# EAGLE design schematic_v1 (EAGLE 9.6.2)
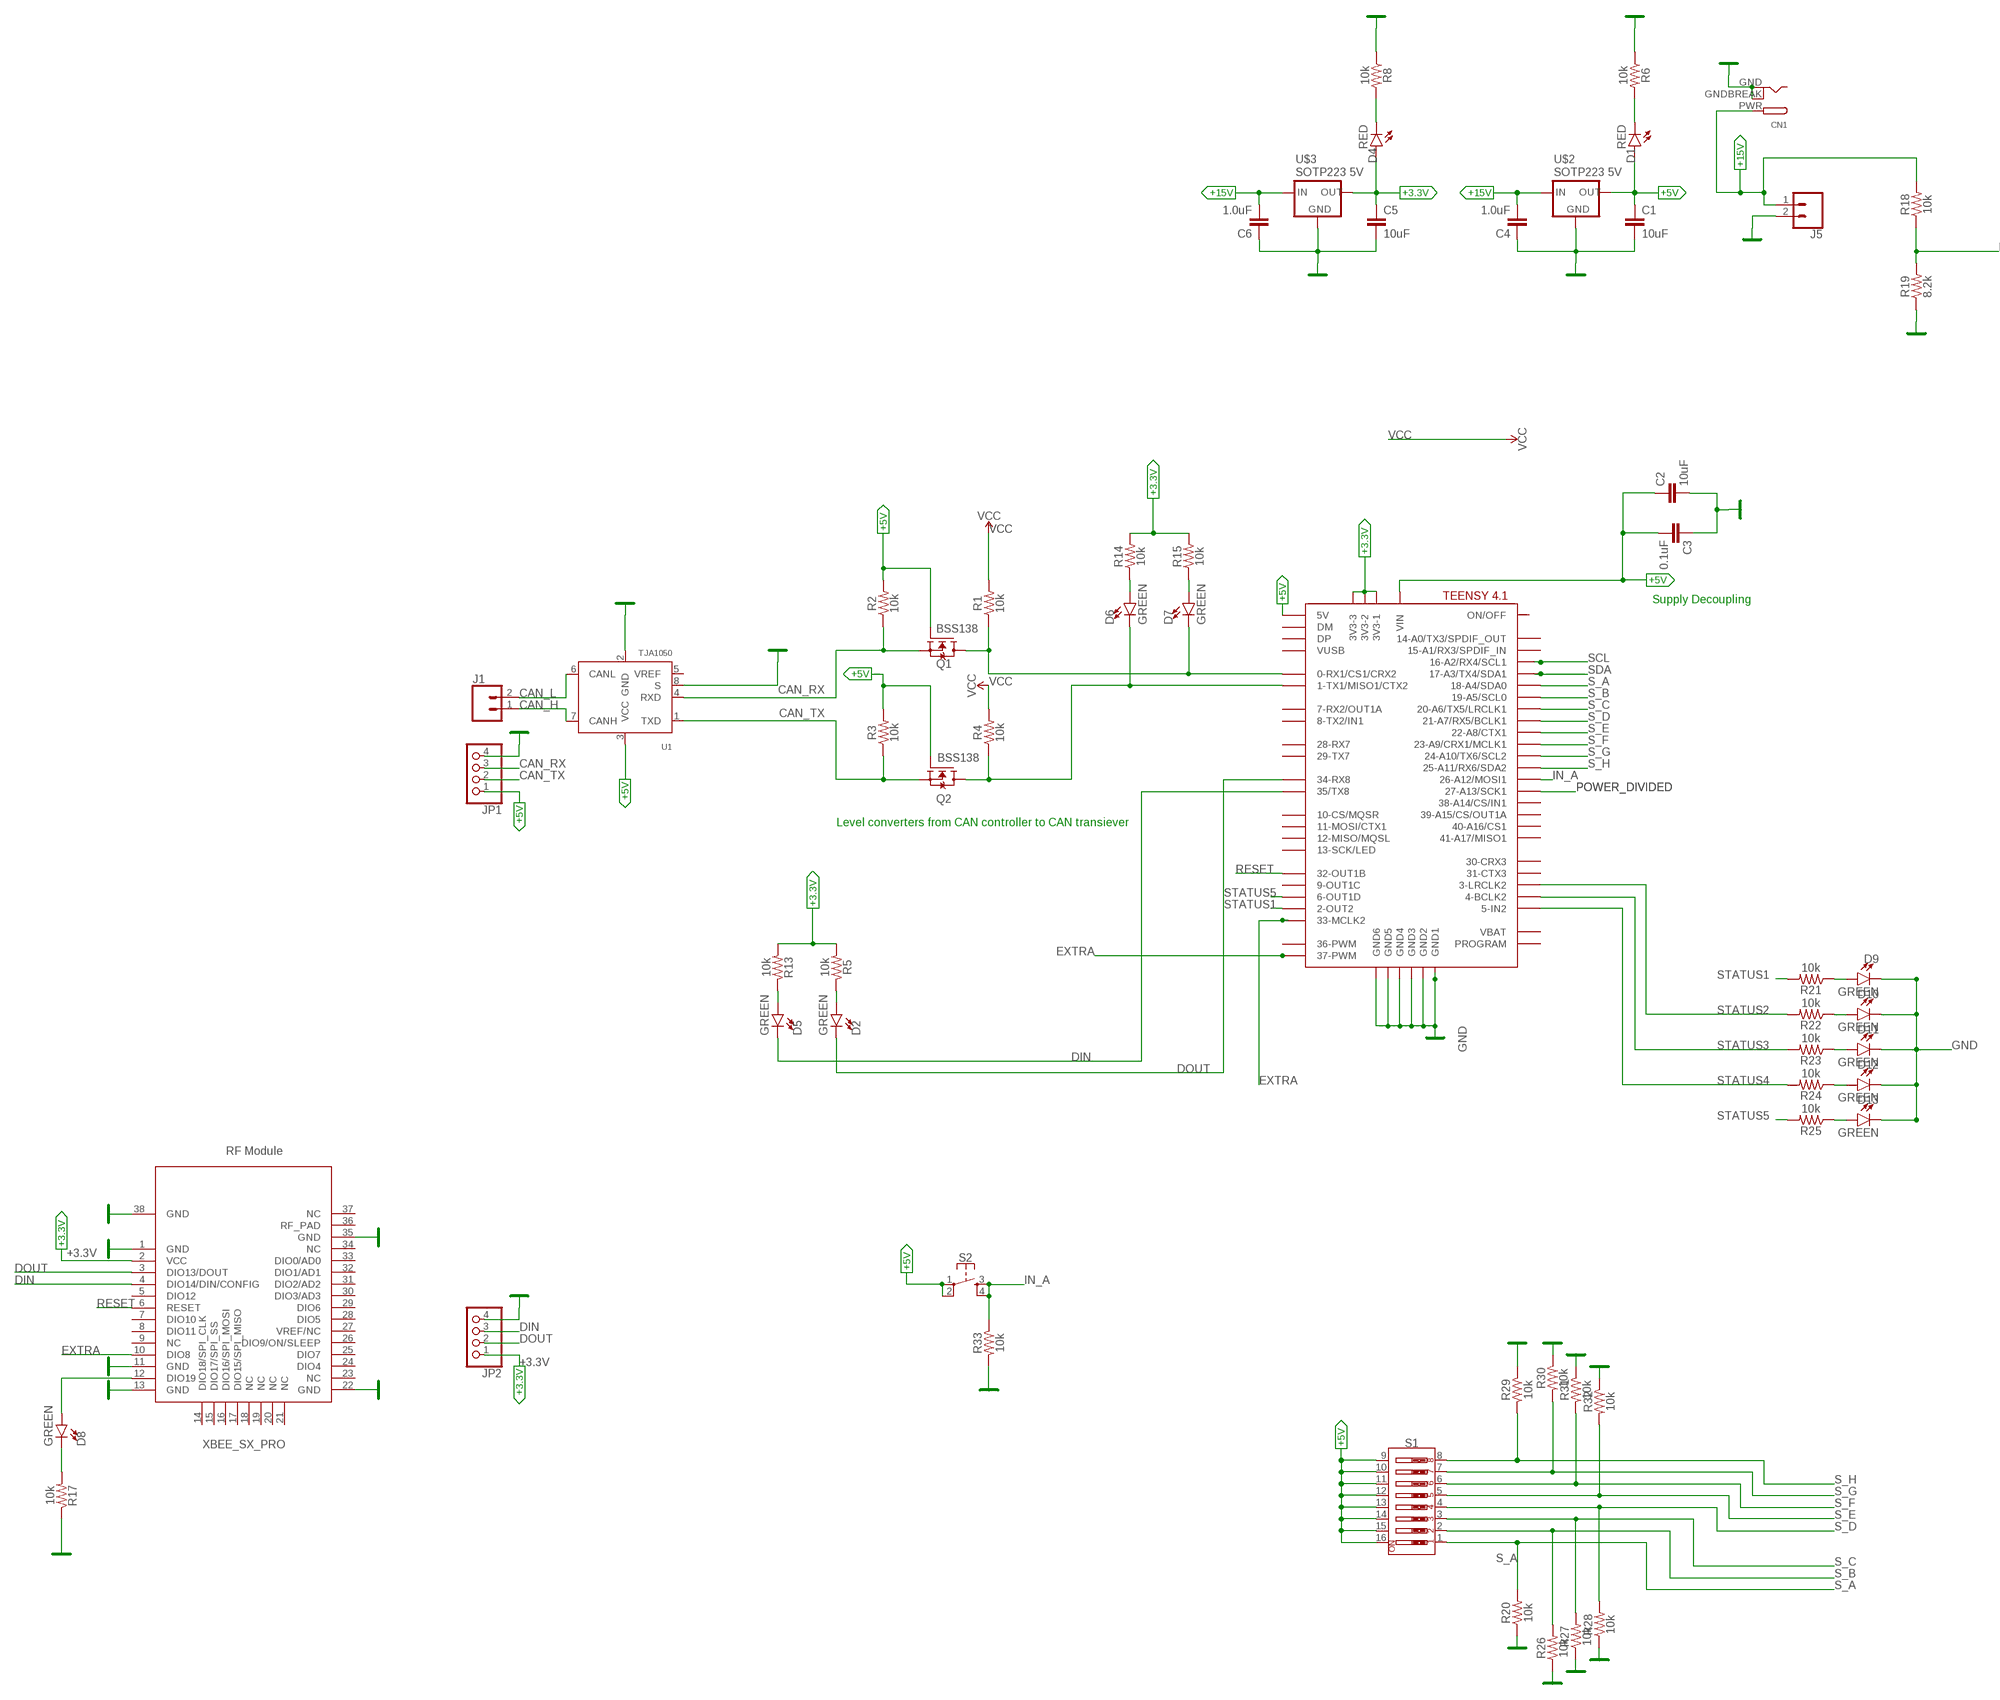
[diagram p0: schematic, sheet 1, part 1 of 2]
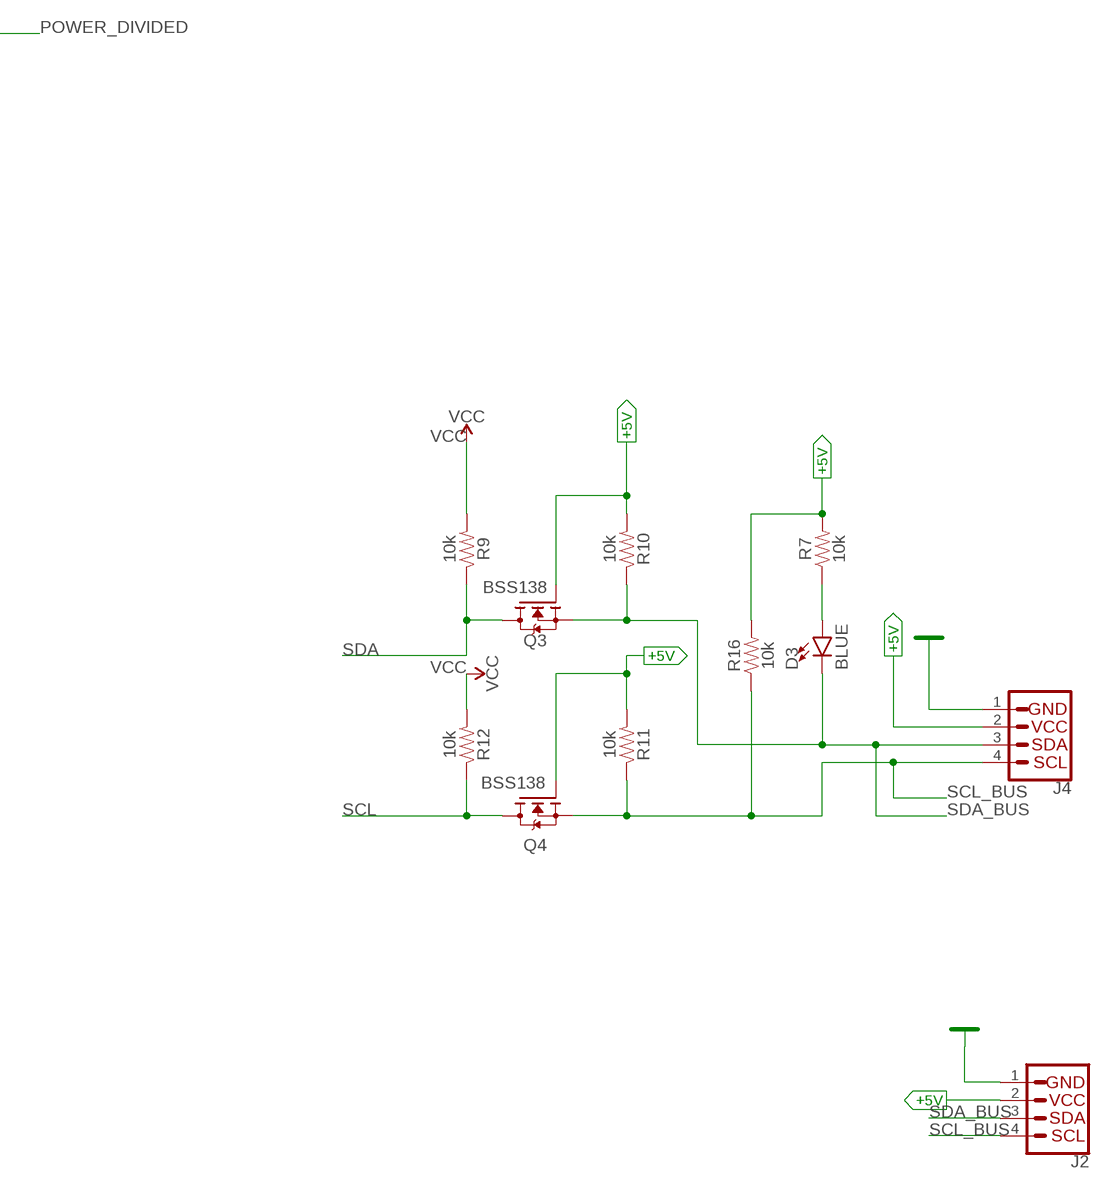
[diagram p1: schematic, sheet 1, part 2 of 2]

## Parts
C1  10uF  10UF-0603-6.3V-20%  [0603]
C2  10uF  10UF-0603-6.3V-20%  [0603]
C3  0.1uF  0.1UF-0603-25V-(+80/-20%)  [0603]
C4  1.0uF  1.0UF-0603-16V-10%  [0603]
C5  10uF  10UF-0603-6.3V-20%  [0603]
C6  1.0uF  1.0UF-0603-16V-10%  [0603]
CN1  DCBARRELPTH  [DCJACK_2MM_PTH]
D1  RED  LED-RED0603  [LED-0603]
D2  GREEN  LED-GREEN0603  [LED-0603]
D3  BLUE  LED-BLUE0603  [LED-0603]
D4  RED  LED-RED0603  [LED-0603]
D5  GREEN  LED-GREEN0603  [LED-0603]
D6  GREEN  LED-GREEN0603  [LED-0603]
D7  GREEN  LED-GREEN0603  [LED-0603]
D8  GREEN  LED-GREEN0603  [LED-0603]
D9  GREEN  LED-GREEN0603  [LED-0603]
D10  GREEN  LED-GREEN0603  [LED-0603]
D11  GREEN  LED-GREEN0603  [LED-0603]
D12  GREEN  LED-GREEN0603  [LED-0603]
D13  GREEN  LED-GREEN0603  [LED-0603]
J1  CONN_02  [1X02]
J2  I2C_STANDARD  [1X04]
J4  I2C_STANDARD  [1X04]
J5  CONN_02LOCK_LONGPADS  [1X02_LOCK_LONGPADS]
JP1  PINHD-1X4  [1X04]
JP2  PINHD-1X4  [1X04]
Q1  BSS138  [SOT95P240X111-3N]
Q2  BSS138  [SOT95P240X111-3N]
Q3  BSS138  [SOT95P240X111-3N]
Q4  BSS138  [SOT95P240X111-3N]
R1  10k  10KOHM-0603-1/10W-1%  [0603]
R2  10k  10KOHM-0603-1/10W-1%  [0603]
R3  10k  10KOHM-0603-1/10W-1%  [0603]
R4  10k  10KOHM-0603-1/10W-1%  [0603]
R5  10k  10KOHM-0603-1/10W-1%  [0603]
R6  10k  10KOHM-0603-1/10W-1%  [0603]
R7  10k  10KOHM-0603-1/10W-1%  [0603]
R8  10k  10KOHM-0603-1/10W-1%  [0603]
R9  10k  10KOHM-0603-1/10W-1%  [0603]
R10  10k  10KOHM-0603-1/10W-1%  [0603]
R11  10k  10KOHM-0603-1/10W-1%  [0603]
R12  10k  10KOHM-0603-1/10W-1%  [0603]
R13  10k  10KOHM-0603-1/10W-1%  [0603]
R14  10k  10KOHM-0603-1/10W-1%  [0603]
R15  10k  10KOHM-0603-1/10W-1%  [0603]
R16  10k  10KOHM-0603-1/10W-1%  [0603]
R17  10k  10KOHM-0603-1/10W-1%  [0603]
R18  10k  10KOHM-0603-1/10W-1%  [0603]
R19  8.2k  8.2KOHM-0603-1/10W-5%  [0603]
R20  10k  10KOHM-0603-1/10W-1%  [0603]
R21  10k  10KOHM-0603-1/10W-1%  [0603]
R22  10k  10KOHM-0603-1/10W-1%  [0603]
R23  10k  10KOHM-0603-1/10W-1%  [0603]
R24  10k  10KOHM-0603-1/10W-1%  [0603]
R25  10k  10KOHM-0603-1/10W-1%  [0603]
R26  10k  10KOHM-0603-1/10W-1%  [0603]
R27  10k  10KOHM-0603-1/10W-1%  [0603]
R28  10k  10KOHM-0603-1/10W-1%  [0603]
R29  10k  10KOHM-0603-1/10W-1%  [0603]
R30  10k  10KOHM-0603-1/10W-1%  [0603]
R31  10k  10KOHM-0603-1/10W-1%  [0603]
R32  10k  10KOHM-0603-1/10W-1%  [0603]
R33  10k  10KOHM-0603-1/10W-1%  [0603]
S1  DIP-08-PTH  [DIPSWITCH-08]
S2  MOMENTARY-SWITCH-SPST-2-SMD-5.2MM  [TACTILE_SWITCH_SMD_5.2MM]
U1  TJA1050  [SOT96-1]
U$1  XBEE_SX_PRO  [XBEE_SX_PRO]
U$2  SOTP223 5V  V_REG_LD1117VXXLD1117-SMD  [SOT223]
U$3  SOTP223 5V  V_REG_LD1117VXXLD1117-SMD  [SOT223]
U$4  TEENSY41-E  [TENNSY41-E]

## Nets
+3.3V: C5.1 D4.A JP2.1 R5.2 R13.2 R14.2 R15.2 U$1.2(VCC) U$3.2(OUT) U$4.3V3-1 U$4.3V3-2 U$4.3V3-3
+5V: C1.1 C2.1 C3.2 D1.A J2.2 J4.2 JP1.1 Q1.1(G) Q2.1(G) Q3.1(G) Q4.1(G) R2.2 R3.2 R7.2 R10.2 R11.2 R16.2 S1.9 S1.10 S1.11 S1.12 S1.13 S1.14 S1.15 S1.16 S2.1 S2.2 U1.3(VCC) U$2.2(OUT) U$4.+5V(5V) U$4.VIN
+15V: C4.2 C6.2 CN1.PWR J5.1 R18.2 U$2.3(IN) U$3.3(IN)
CAN_H: J1.1 U1.7(CANH)
CAN_L: J1.2 U1.6(CANL)
CAN_RX: JP1.3 Q1.2(S) R2.1 U1.4(RXD)
CAN_TX: JP1.2 Q2.2(S) R3.1 U1.1(TXD)
DIN: D5.C JP2.3 U$1.4(DIO14/DIN/CONFIG) U$4.35-TX8(35/TX8)
DOUT: D2.C JP2.2 U$1.3(DIO13/DOUT) U$4.34-RX8
EXTRA: U$1.10(DIO8) U$4.33-MCLK2
GND: C1.2 C2.2 C3.1 C4.1 C5.2 C6.1 CN1.GND CN1.GNDBREAK D9.C D10.C D11.C D12.C D13.C J2.1 J4.1 J5.2 JP1.4 JP2.4 R6.1 R8.1 R17.1 R19.1 R20.1 R26.1 R27.1 R28.1 R29.1 R30.1 R31.1 R32.1 R33.2 U1.2(GND) U1.8(S) U$1.1(GND) U$1.11(GND) U$1.13(GND) U$1.22(GND) U$1.35(GND) U$1.38(GND) U$2.1(GND) U$3.1(GND) U$4.GND1 U$4.GND2 U$4.GND3 U$4.GND4 U$4.GND5 U$4.GND6
IN_A: R33.1 S2.3 S2.4 U$4.26-A12/MOSI1
N$4: D3.A R7.1
N$5: D7.C Q1.3(D) R1.1 U$4.0-RX1/CS1/CRX2
N$6: D5.A R13.1
N$7: D1.C R6.2
N$8: D2.A R5.1
N$10: D4.C R8.2
N$11: D6.C Q2.3(D) R4.1 U$4.1-TX1/MISO1/CTX2
N$12: D8.A U$1.12(DIO19)
N$13: D7.A R15.1
N$14: D6.A R14.1
N$15: U$4.37-PWM
N$16: D9.A R21.1
N$18: D10.A R22.1
N$20: D11.A R23.1
N$22: D12.A R24.1
N$24: D13.A R25.1
N$25: D8.C R17.2
POWER_DIVIDED: R18.1 R19.2 U$4.27-A13/SCK1
RESET: U$1.6(RESET) U$4.32-OUT1B
S_A: R20.2 S1.1 U$4.18-A4/SDA0
S_B: R26.2 S1.2 U$4.19-A5/SCL0
S_C: R27.2 S1.3 U$4.20-A6/TX5/LRCLK1
S_D: R28.2 S1.4 U$4.21-A7/RX5/BCLK1
S_E: R32.2 S1.5 U$4.22-A8/CTX1
S_F: R31.2 S1.6 U$4.23-A9/CRX1/MCLK1
S_G: R30.2 S1.7 U$4.24-A10/TX6/SCL2
S_H: R29.2 S1.8 U$4.25-A11/RX6/SDA2
SCL: Q4.3(D) R12.1 U$4.16-A2/RX4/SCL1
SCL_BUS: J2.4 J4.4 Q4.2(S) R11.1 R16.1
SDA: Q3.3(D) R9.1 U$4.17-A3/TX4/SDA1
SDA_BUS: D3.C J2.3 J4.3 Q3.2(S) R10.1
STATUS1: R21.2 U$4.2-OUT2
STATUS2: R22.2 U$4.3-LRCLK2
STATUS3: R23.2 U$4.4-BCLK2
STATUS4: R24.2 U$4.5-IN2
STATUS5: R25.2 U$4.6-OUT1D
VCC: R1.2 R4.2 R9.2 R12.2
Unconnected: U1.5(VREF) U$1.5(DIO12) U$1.7(DIO10) U$1.8(DIO11) U$1.9(NC) U$1.14(DIO18/SPI_CLK) U$1.15(DIO17/SPI_SS) U$1.16(DIO16/SPI_MOSI) U$1.17(DIO15/SPI_MISO) U$1.18(NC) U$1.19(NC) U$1.20(NC) U$1.21(NC) U$1.23(NC) U$1.24(DIO4) U$1.25(DIO7) U$1.26(DIO9/ON/SLEEP) U$1.27(VREF/NC) U$1.28(DIO5) U$1.29(DIO6) U$1.30(DIO3/AD3) U$1.31(DIO2/AD2) U$1.32(DIO1/AD1) U$1.33(DIO0/AD0) U$1.34(NC) U$1.36(RF_PAD) U$1.37(NC) U$4.7-RX2/OUT1A U$4.8-TX2/IN1 U$4.9-OUT1C U$4.10-CS\MQSR(10-CS/MQSR) U$4.11-MOSI/CTX1 U$4.12-MISO/MQSL U$4.13-SCK/LED U$4.14-A0/TX3/SPDIF_OUT U$4.15-A1/RX3/SPDIF_IN U$4.28-RX7 U$4.29-TX7 U$4.30-CRX3 U$4.31-CTX3 U$4.36-PWM U$4.38-A14/CS/IN1 U$4.39-A15/CS/OUT1A U$4.40-A16/CS1 U$4.41-A17/MISO1 U$4.DM U$4.DP U$4.ON/OFF U$4.PROGRAM U$4.VBAT U$4.VUSB

## Notes on the sheet
- Supply Decoupling
- Level converters from CAN controller to CAN transiever

## Library data of the parts
C1 C2 C5 = SparkFun-Capacitors:10UF: 10.0µF ceramic capacitors A capacitor is a passive two-terminal electrical component used to store electrical energy temporarily in an electric field.; PROD_ID: CAP-11015
C3 = SparkFun-Capacitors:0.1UF: 0.1µF ceramic capacitors A capacitor is a passive two-terminal electrical component used to store electrical energy temporarily in an electric field.; PROD_ID: CAP-00810
C4 C6 = SparkFun-Capacitors:1.0UF: 1µF ceramic capacitors A capacitor is a passive two-terminal electrical component used to store electrical energy temporarily in an electric field.; PROD_ID: CAP-00868
CN1 = adafruit:DCBARREL: 2.0mm DC Barrel Jack DCJACK_2MM_PTH - Through Hole Jack (4UConnector: 05537)
D1 D4 = SparkFun-LED:LED-RED: Red SMD LED Used in manufacturing of most products at SparkFun Packages: 0603 - SMD 0603 package [Product Link] <http://docs.avagotech.com/docs/AV02-0551EN> 0603 SMART - SMD 0603 SMART package ( more efficient and expensive)[Product Link] <http://www.osram-os.com/Graphics/XPic2/00077099_0.pdf> 1206 - SMD1206 package [Product Link] <https://www.sparkfun.com/datasheets/DevTools/LilyPad/Q150OVS4.pdff> SparkFun Products: Pro Mini 328 -5V <https://www.sparkfun.com/products/821> RedBoard <https://www.sparkfun.com/products/12757> IOIO-OTG <https://www.sparkfun.com/products/13613>; PROD_ID: DIO-00819
D2 D5-D13 = SparkFun-LED:LED-GREEN: Green SMD LED Used in manufacturing of various products at SparkFun Packages: 0603 - SMD 0603 package [Product Link] <http://www.futureelectronics.com/en/technologies/semiconductors/optoelectronics/leds/Pages/9894312-LTST-C190GKT.aspx?CrossPart=HSMG-C190&IM=0> LilyPad 1206 - SMD1206 LilyPad package [Product Link] <http://www.futureelectronics.com/en/Technologies/Product.aspx?ProductID=IN150NGHARVATEKCORPORATION2049943&IM=0> 1206 - SMD1206 package [Product Link] <http://www.futureelectronics.com/en/technologies/semiconductors/optoelectronics/leds/Pages/8315665-LTST-C150KGKT.aspx?IM=0> 1206 Bottom Mount -SMD 1206 Bottom Mount [Product Link] <http://www.digikey.com/product-detail/en/lite-on-inc/LTST-C230KGKT/160-1456-1-ND/386854> SparkFun Products: Pro Mini 328 -5V <https://www.sparkfun.com/products/821> RedBoard <https://www.sparkfun.com/products/12757> MP3 Trigger <https://www.sparkfun.com/products/13720> Makey Makey <https://www.sparkfun.com/products/11076>; PROD_ID: DIO-00821
D3 = SparkFun-LED:LED-BLUE: Blue SMD LED Used in manufacturing of various products at SparkFun Packages: 0603 - SMD 0603 package [Product Link] <http://www.digikey.com/product-detail/en/SMLE12BC7TT86/511-1589-2-ND/1641808> 1206 - SMD1206 package [Product Link] <http://www.digikey.com/product-detail/en/lite-on-inc/LTST-C150TBKT/160-1643-1-ND/573584> SparkFun Products: ESP8266 Thing-Dev Board <https://www.sparkfun.com/products/13711> RedBoard <https://www.sparkfun.com/products/12757>; PROD_ID: DIO-08575
J1 J5 = SparkFun-Connectors:CONN_02: Multi connection point. Often used as Generic Header-pin footprint for 0.1 inch spaced/style header connections On any of the 0.1 inch spaced packages, you can populate with these: Break Away Headers - Straight <https://www.sparkfun.com/products/116> (PRT-00116) Break Away Male Headers - Right Angle <https://www.sparkfun.com/products/553> (PRT-00553) Female Headers <https://www.sparkfun.com/products/115> (PRT-00115) Break Away Headers - Machine Pin <https://www.sparkfun.com/products/117> (PRT-00117) Break Away Female Headers - Swiss Machine Pin <https://www.sparkfun.com/products/743> (PRT-00743) For SCREWTERMINALS and SPRING TERMINALS visit here: Screw Terimnals on SparkFun.com <https://www.sparkfun.com/search/results?term=Screw+Terminals> (5mm/3.5mm/2.54mm spacing) This device is also useful as a general connection point to wire up your design to another part of your project. Our various solder wires solder well into these plated through hole pads. Hook-Up Wire - Assortment (Stranded, 22 AWG) <https://www.sparkfun.com/products/11375> (PRT-11375) Hook-Up Wire - Assortment (Solid Core, 22 AWG) <https://www.sparkfun.com/products/11367> (PRT-11367) View the entire wire category on our website here <https://www.sparkfun.com/categories/141> Special notes: Molex polarized connector foot print use with: PRT-08233 with associated crimp pins and housings. 2.54_SCREWTERM for use with PRT-10571. 3.5mm Screw Terminal footprints for PRT-08084 5mm Screw Terminal footprints for use with PRT-08432
J2 J4 = SparkFun-Connectors:I2C_STANDARD: SparkFun I2C Standard Pinout Header SparkFun has standardized on a pinout for all I2C based sensor breakouts. This pinout allows I2C boards to be plugged directly into the headers on Arduino Uno compatible boards, and to be daisy chained easily. Example SparkFun Products: SparkFun Atmospheric Sensor Breakout - BME280 <https://www.sparkfun.com/products/13676> SparkFun Altitude/Pressure Sensor Breakout - MPL3115A2 <https://www.sparkfun.com/products/11084> SparkFun TOF Range Finder Sensor - VL6180 <https://www.sparkfun.com/products/12785>
JP1 JP2 = pinhead:PINHD-1X4: PIN HEADER
Q1 Q2 = BSS138:BSS138: N-Channel 50V 220mA (Ta) 360mW (Ta) Surface Mount SOT-23-3 Check prices <https://pricing.snapeda.com/search/part/BSS138/?ref=eda>; AVAILABILITY: Good; DESCRIPTION: N-Channel 50V 220mA (Ta) 360mW (Ta) Surface Mount SOT-23-3; MF: ON Semiconductor; MP: BSS138; PACKAGE: SOT-23 ON Semiconductor; PRICE: None; PURCHASE-URL: https://pricing.snapeda.com/search/part/BSS138/?ref=eda
Q3 Q4 = BSS138:BSS138: N-Channel 50V 220mA (Ta) 360mW (Ta) Surface Mount SOT-23-3 Check prices <https://pricing.snapeda.com/search/part/BSS138/?ref=eda>; AVAILABILITY: Good; DESCRIPTION: N-Channel 50V 220mA (Ta) 360mW (Ta) Surface Mount SOT-23-3; MF: ON Semiconductor; MP: BSS138; PACKAGE: SOT-23 ON Semiconductor; PRICE: None; PURCHASE-URL: https://pricing.snapeda.com/search/part/BSS138/?ref=eda; SPICEPREFIX: Q
R1-R8 R13-R18 R20-R33 = SparkFun-Resistors:10KOHM: 10kΩ resistor A resistor is a passive two-terminal electrical component that implements electrical resistance as a circuit element. Resistors act to reduce current flow, and, at the same time, act to lower voltage levels within circuits. - Wikipedia; PROD_ID: RES-00824
R9-R12 = SparkFun-Resistors:10KOHM: 10kΩ resistor A resistor is a passive two-terminal electrical component that implements electrical resistance as a circuit element. Resistors act to reduce current flow, and, at the same time, act to lower voltage levels within circuits. - Wikipedia; PROD_ID: RES-00824; SPICEPREFIX: R
R19 = SparkFun-Resistors:8.2KOHM: 8.2kΩ resistor A resistor is a passive two-terminal electrical component that implements electrical resistance as a circuit element. Resistors act to reduce current flow, and, at the same time, act to lower voltage levels within circuits. - Wikipedia; PROD_ID: RES-10646
S1 = SparkFun-Switches:DIP-08: 8-Position DIP Switch 8-circuit DIP (dual inline package) switch. Commonly used to physcially set a circuit's behavior. SparkFun Products DIP Switch - 8 Position <https://www.sparkfun.com/products/8034> (COM-08034); PROD_ID: SWCH-12197; SF_SKU: COM-08034
S2 = SparkFun-Switches:MOMENTARY-SWITCH-SPST-2: Momentary Switch (Pushbutton) - SPST - Two Circuits Normally-open (NO) SPST momentary switches (buttons, pushbuttons). Schematic symbol includes two switch circuits. Variants SMD-4.6MMX2.8MM - 4.60mm x 2.80mm Tactile Momentary Button Switch - Used on SparkFun SAMD21 Mini Breakout <https://www.sparkfun.com/products/13664> SMD-5.2MM - Mini Pushbutton Switch - SMD <https://www.sparkfun.com/products/8720> - Used on Arduino Pro Mini <https://www.sparkfun.com/products/11114>; PROD_ID: SWCH-08247; SF_SKU: COM-08720
U1 = TJA1050:TJA1050: High speed CAN transceiver The TJA1050 is the interface between the Controller Area Network (CAN) protocol controller and the physical bus. The device provides differential transmit capability to the bus and differential receive capability to the CAN controller. The TJA1050 is the third Philips high-speed CAN transceiver after the PCA82C250 and the PCA82C251. The most important differences are: Much lower electromagnetic emission due to optimal matching of the output signals CANH and CANL Improved behaviour in case of an unpowered node No standby mode. This makes the TJA1050 eminently suitable for use in nodes that are in a power-down situation in partially powered networks. AAL Eindhoven MK; AVAILABILITY: Unavailable; DESCRIPTION: 1/1 Transceiver Half CANbus 8-SO; MF: NXP USA; MP: TJA1050; PACKAGE: SOIC-8 NXP Semiconductors; PRICE: None
U$1 = xbee_sx_pro:XBEE_SX_PRO
U$2 U$3 = SparkFun-IC-Power:V_REG_LD1117VXX: LD1117VXX voltage regulator. We carry the 3.3V version (COM-00526) in TO-220 package.; PROD_ID: VREG-13917
U$4 = teensy:TEENSY41-E

## Board
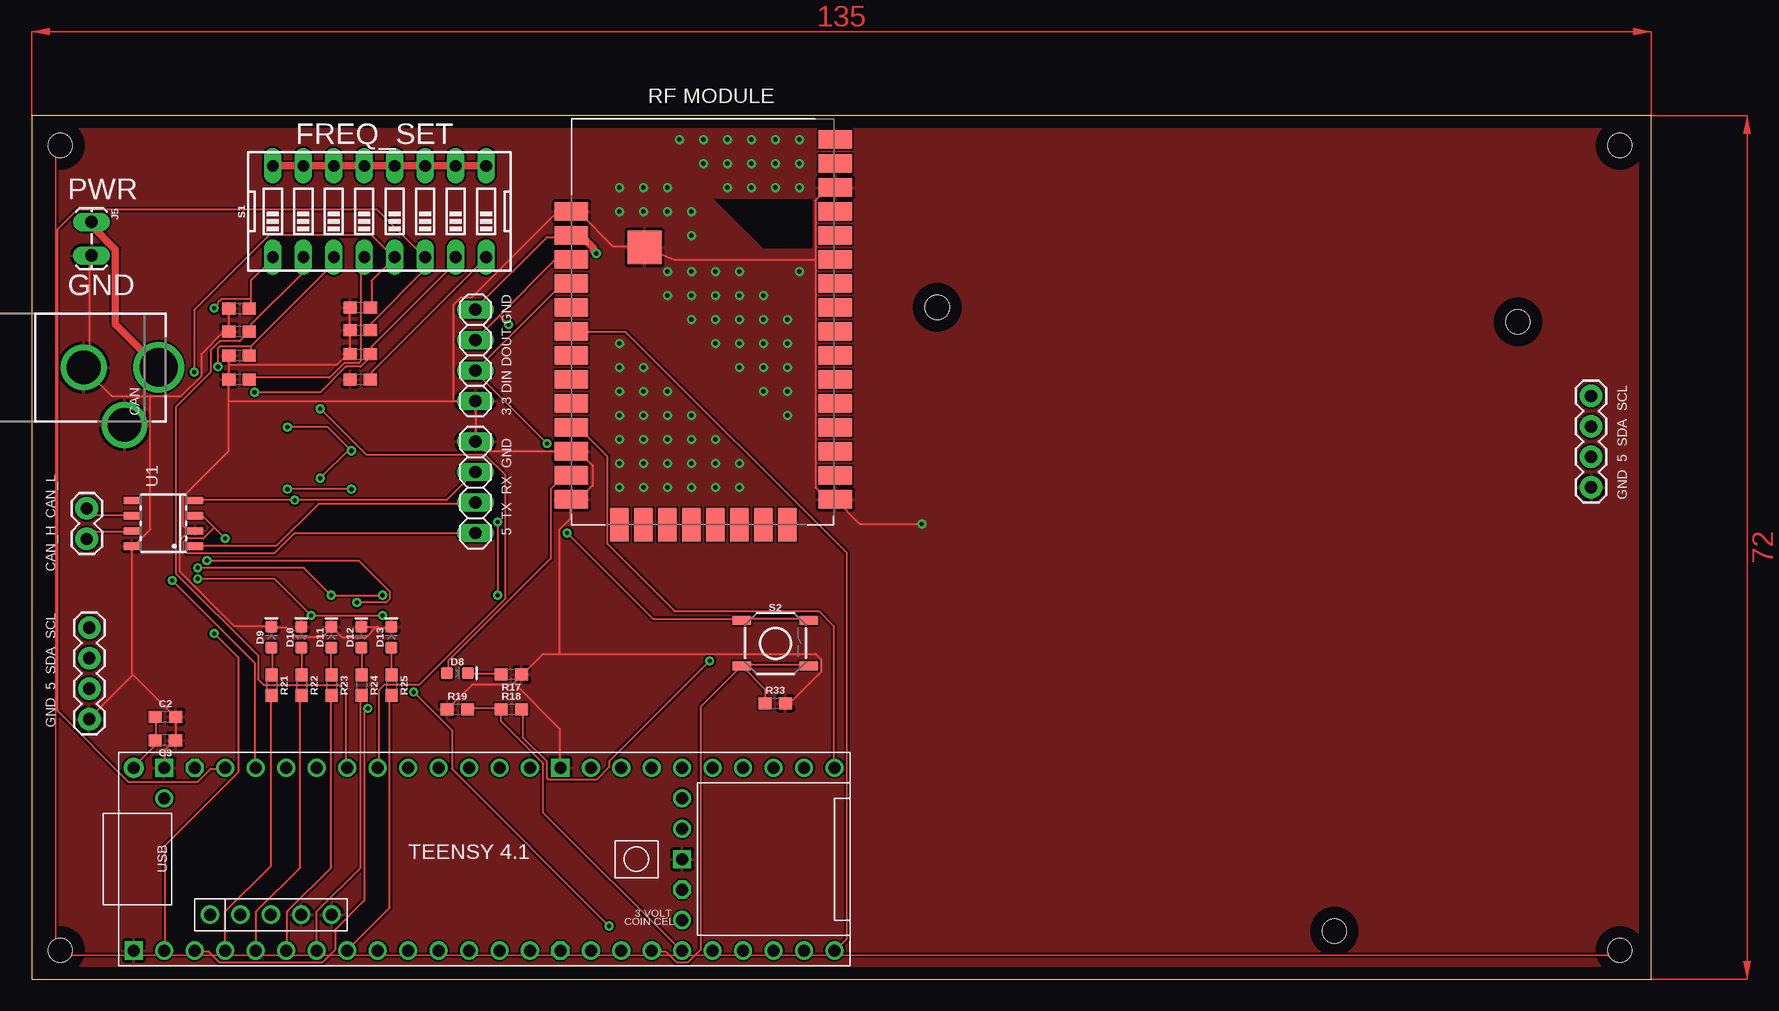
[diagram p2: board, top side]
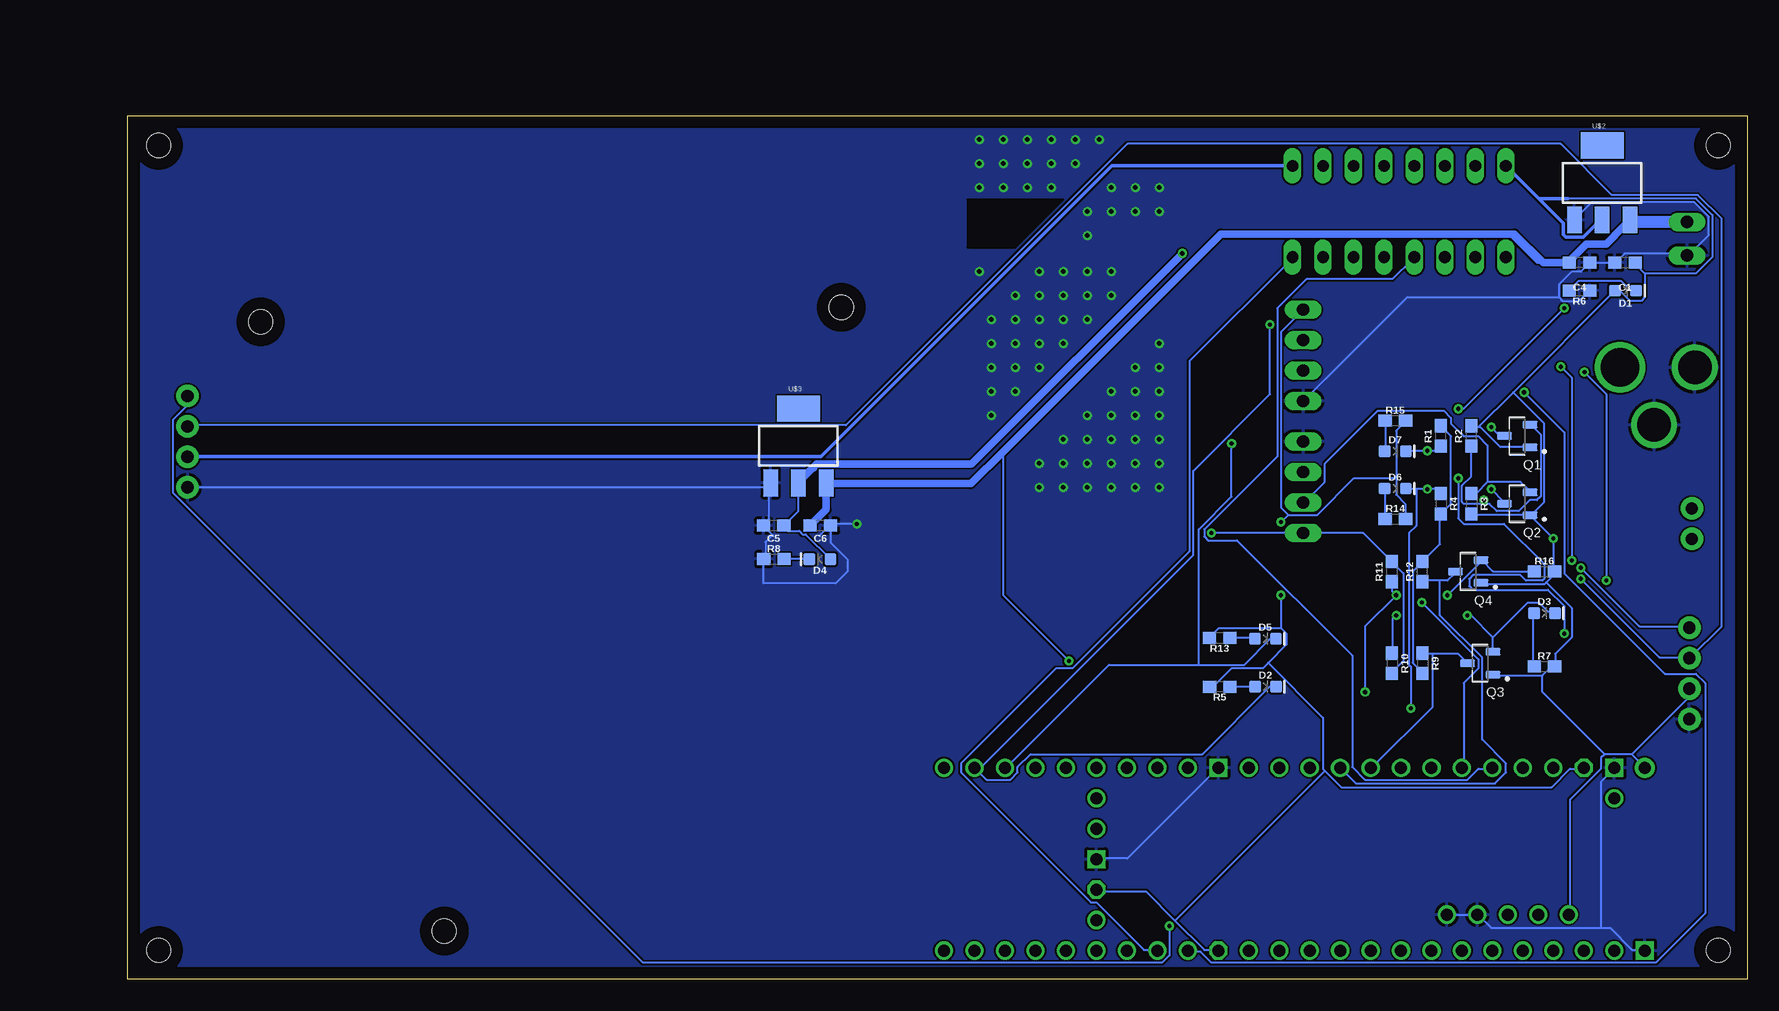
[diagram p3: board, bottom side, seen from below]

Size 135 x 72 mm. Coordinates in mm from the lower left corner, seen from the top.
Outline: 0,0 135,0 135,72 0,72 0,0
Copper layers (1*16): Top 0.035mm / dielectric 1.5mm / Bottom 0.035mm
Design rules "default": minimum track width 6mil, minimum drill 0.35mm, track to track 6mil, track to pad 6mil, pad to pad 6mil, via to via 6mil, smd to smd 6mil, copper to edge 40mil, drill to drill 6mil, minimum pad ring 10mil, minimum via ring 8mil, stop-mask expansion 4mil, vias tented up to drill 0mil, thermal gap 10mil
Holes 2 mm at 132.4,69.5 2.4,2.4 132.4,2.4 2.4,69.5 123.9,54.8 108.6,4 75.5,56
tRestrict: area 57,61 to 65,65
bRestrict: area 57,61 to 65,65

### Footprints (pad centres in the part's own frame; a part is rotated, then mirrored left to right if it is on the bottom)
0603 = smd 1.1 x 1: 1 -0.85,0; 2 0.85,0
DCJACK_2MM_PTH = drill 2.8: GND 0,7.35; GNDBREAK 4.8,10.75 | drill 3.2: PWR 0,13.6
LED-0603 = smd 1 x 1: A -0.877,0; C 0.877,0
1X02 = drill 1.016 pad 1.88: 1 0,0; 2 2.54,0
1X04 = drill 1.016 pad 1.88: 1 0,0; 2 2.54,0; 3 5.08,0; 4 7.62,0
1X02_LOCK_LONGPADS = drill 1.016 long: 1 -0.127,0; 2 2.667,0
1X04' = drill 1.016 long: 1 -3.81,0; 2 -1.27,0; 3 1.27,0; 4 3.81,0
SOT95P240X111-3N = smd 1.23 x 0.6: 1 -1.06,0.95; 2 -1.06,-0.95; 3 1.06,0
DIPSWITCH-08 = drill 0.97 long: 1 -8.89,-3.81; 2 -6.35,-3.81; 3 -3.81,-3.81; 4 -1.27,-3.81; 5 1.27,-3.81; 6 3.81,-3.81; 7 6.35,-3.81; 8 8.89,-3.81; 9 8.89,3.81; 10 6.35,3.81; 11 3.81,3.81; 12 1.27,3.81; 13 -1.27,3.81; 14 -3.81,3.81; 15 -6.35,3.81; 16 -8.89,3.81
TACTILE_SWITCH_SMD_5.2MM = smd 1.524 x 0.762: 1 -2.794,1.905; 2 2.794,1.905; 3 -2.794,-1.905; 4 2.794,-1.905
SOT96-1 = smd 0.6 x 1.3: 1 -1.905,-2.65; 2 -0.635,-2.65; 3 0.635,-2.65; 4 1.905,-2.65; 5 1.905,2.65; 6 0.635,2.65; 7 -0.635,2.65; 8 -1.905,2.65
XBEE_SX_PRO = smd 2.8 x 1.52: 1 0,24; 2 0,22; 3 0,20; 4 0,18; 5 0,16; 6 0,14; 7 0,12; 8 0,10; 9 0,8; 10 0,6; 11 0,4; 12 0,2; 13 0,0; 22 22,0; 23 22,2; 24 22,4; 25 22,6; 26 22,8; 27 22,10; 28 22,12; 29 22,14; 30 22,16; 31 22,18; 32 22,20; 33 22,22; 34 22,24; 35 22,26; 36 22,28; 37 22,30 | smd 1.52 x 2.8: 14 4,-2.127; 15 6,-2.127; 16 8,-2.127; 17 10,-2.127; 18 12,-2.127; 19 14,-2.127; 20 16,-2.127; 21 18,-2.127 | smd 2.8 x 2.8: 38 6.1,21
SOT223 = smd 1.219 x 2.235: 1 -2.311,-3.099; 2 0,-3.099; 3 2.311,-3.099 | smd 3.6 x 2.2: 4 0,3.099
TENNSY41-E = drill 1: 0-RX1/CS1/CRX2 -27.94,-7.62; 1-TX1/MISO1/CTX2 -25.4,-7.62; 2-OUT2 -22.86,-7.62; 3-LRCLK2 -20.32,-7.62; 4-BCLK2 -17.78,-7.62; 5-IN2 -15.24,-7.62; 6-OUT1D -12.7,-7.62; 7-RX2/OUT1A -10.16,-7.62; 8-TX2/IN1 -7.62,-7.62; 9-OUT1C -5.08,-7.62; 10-CS\MQSR -2.54,-7.62; 11-MOSI/CTX1 0,-7.62; 12-MISO/MQSL 2.54,-7.62; 13-SCK/LED 2.54,7.62; 14-A0/TX3/SPDIF_OUT 0,7.62; 15-A1/RX3/SPDIF_IN -2.54,7.62; 16-A2/RX4/SCL1 -5.08,7.62; 17-A3/TX4/SDA1 -7.62,7.62; 18-A4/SDA0 -10.16,7.62; 19-A5/SCL0 -12.7,7.62; 20-A6/TX5/LRCLK1 -15.24,7.62; 21-A7/RX5/BCLK1 -17.78,7.62; 22-A8/CTX1 -20.32,7.62; 23-A9/CRX1/MCLK1 -22.86,7.62; 24-A10/TX6/SCL2 7.62,-7.62; 25-A11/RX6/SDA2 10.16,-7.62; 26-A12/MOSI1 12.7,-7.62; 27-A13/SCK1 15.24,-7.62; 28-RX7 17.78,-7.62; 29-TX7 20.32,-7.62; 30-CRX3 22.86,-7.62; 31-CTX3 25.4,-7.62; 32-OUT1B 27.94,-7.62; 33-MCLK2 27.94,7.62; 34-RX8 25.4,7.62; 35-TX8 22.86,7.62; 36-PWM 20.32,7.62; 37-PWM 17.78,7.62; 38-A14/CS/IN1 15.24,7.62; 39-A15/CS/OUT1A 12.7,7.62; 40-A16/CS1 10.16,7.62; 41-A17/MISO1 7.62,7.62; +5V -24.13,-4.62; DM -21.59,-4.62; DP -19.05,-4.62; GND4 -16.51,-4.62; GND5 -13.97,-4.62; ON/OFF 15.24,5.08; PROGRAM 15.24,2.54; VBAT 15.24,-5.08; VUSB -27.94,5.08 | drill 1 octagon: 3V3-1 5.08,-7.62; 3V3-2 15.24,-2.54; 3V3-3 -25.4,7.62 | drill 1 square: GND1 -30.48,-7.62; GND2 15.24,0; GND3 5.08,7.62; GND6 -27.94,7.62 | drill 1 pad 1.676: VIN -30.48,7.62

### Placement (x,y rotation side)
C1  10.17,59.72 180 bottom
C2  11.16,21.88 0 top
C3  11.15,19.92 180 top
C4  13.97,59.74 180 bottom
C5  81.14,37.8 180 bottom
C6  77.25,37.8 180 bottom
CN1  -3,51 270 top
D1  10.13,57.4 0 bottom
D2  40.14,24.39 0 bottom
D3  16.89,30.52 0 bottom
D4  77.28,35.01 180 bottom
D5  40.15,28.39 0 bottom
D6  29.32,40.9 0 bottom
D7  29.32,44.01 0 bottom
D8  35.5,25.5 0 top
D9  20,28.5 90 top
D10  22.5,28.5 90 top
D11  25,28.5 90 top
D12  27.5,28.5 90 top
D13  30,28.5 90 top
J1  4.6,36.7 90 top
J2  130,41 90 top
J4  4.81,21.67 90 top
J5  5,63 270 top
JP1  [1X04']  37,41 90 top
JP2  [1X04']  37,52 270 top
Q1  19.16,45.28 180 bottom
Q2  19.16,39.63 180 bottom
Q3  22.24,26.33 180 bottom
Q4  23.24,33.98 180 bottom
R1  25.51,45.28 90 bottom
R2  22.97,45.28 90 bottom
R3  22.97,39.63 270 bottom
R4  25.51,39.63 270 bottom
R5  43.95,24.37 180 bottom
R6  13.97,57.38 180 bottom
R7  16.89,26.06 0 bottom
R8  81.12,35.01 0 bottom
R9  27.05,26.33 270 bottom
R10  29.59,26.33 270 bottom
R11  29.59,33.98 90 bottom
R12  27.05,33.98 90 bottom
R13  43.97,28.43 180 bottom
R14  29.32,38.36 0 bottom
R15  29.32,46.55 0 bottom
R16  16.89,33.98 0 bottom
R17  40,25.4 180 top
R18  40,22.5 0 top
R19  35.5,22.5 0 top
R20  17.3,55.9 0 top
R21  20,24.5 270 top
R22  22.5,24.5 270 top
R23  25,24.5 270 top
R24  27.5,24.5 270 top
R25  30,24.5 270 top
R26  17.3,54 0 top
R27  17.3,52 0 top
R28  17.3,50 0 top
R29  27.4,50 0 top
R30  27.4,52.1 0 top
R31  27.4,54.1 0 top
R32  27.4,56 0 top
R33  62,23 0 top
S1  29,64 0 top
S2  62,28 0 top
U1  11,38 90 top
U$1  45,40 0 top
U$2  12.08,66.39 0 bottom
U$3  79.08,44.47 0 bottom
U$4  39,10 0 top

### Tracks (layer width: path | path; a pad name or v marks a point on that pad's centre or on a via)
+3.3V  (via drill 0.35)
  Top 0.152: U$1.2 44.95,61.87 42.97,61.87 37.02,55.93 JP2.1 | v38.85,38.1 v38.85,32
  Top 0.61: v47.08,60.5 46.86,60.73 46.86,60.95 45.81,62 U$1.2
  Bottom 0.152: 47.69,4.88 50.13,7.32 54.09,7.32 U$4.3V3-2 | 47.69,4.88 45.25,2.44 44.19,2.44 U$4.3V3-1 | 39.92,26.36 38.39,27.89 38.39,28.8 38.85,29.26 | 39.92,26.36 40.38,25.91 42.97,25.91 44.49,24.38 44.8,24.38 R5.2 | 38.85,29.26 44.03,29.26 44.8,28.5 R13.2 | 35.19,17.37 35.35,17.53 35.35,21.79 39.92,26.36 | 35.19,17.37 33.82,16 16.3,16 14.77,17.53 13.71,17.53 U$4.3V3-3 | 35.19,17.37 47.69,4.88 | 29.25,41.76 29.25,45.72 28.49,46.48 R15.2 | 29.25,41.76 29.25,40.39 28.49,39.62 28.49,38.41 R14.2 | 29.25,41.76 32.76,41.76 35.8,38.71 38.24,38.71 | 38.24,38.71 38.85,39.32 38.85,53.95 37.02,55.78 JP2.1 | v38.85,32 38.85,29.26 | 38.24,38.71 v38.85,38.1 | 77.57,42.95 77.57,42.88 U$3.2 79.08,41 79.08,39.01 C5.1 80.29,37.67 80,37.38 79,37.38 78.88,37.26 78.88,37.2 78.75,37.07 78.46,37.07 D4.A
  Bottom 0.61: 77.83,42.68 77.57,42.95 64.64,42.95 v47.08,60.5 | 77.83,42.62 77.83,42.68 | 77.83,42.68 79.08,41.43 79.08,41
+5V  (via drill 0.35)
  Top 0.152: S2.2 64.76,30.02 59.27,30.02 S2.1 59.12,30.02 51.81,30.02 v44.64,37.19 | v16.14,36.73 15.23,37.64 | 15.23,37.64 14.32,38.56 13.71,38.56 U1.3 | C2.1 10.35,21.79 10.35,19.96 C3.2 10.2,19.81 10.2,19.36 8.52,17.68 U$4.VIN | 15.23,37.64 14.32,36.73 12.94,36.73 12.64,36.42 12.64,35.81 12.94,35.51 20.26,35.51 21.94,37.19 36.87,37.19 JP1.1 | 22,67.82 22.55,67.82 S1.15 | S1.10 35,67.82 33,67.82 32.91,67.82 S1.11 32.76,67.82 30.32,67.82 S1.12 30.16,67.82 28,67.82 27.88,67.82 S1.13 25.29,67.82 S1.14 25.14,67.82 | 37.78,67.82 S1.9
  Top 0.61: S1.16 22,67.82 | S1.15 25.14,67.82 | S1.14 28,67.82 | S1.13 30.32,67.82 | S1.12 33,67.82 | S1.11 35,67.82 | S1.10 37.78,67.82
  Bottom 0.152: R10.2 29.55,25.6 28.64,26.52 28.64,33.83 29.55,34.75 R11.2 29.71,34.9 31.99,37.19 36.87,37.19 JP1.1 37.02,37.19 v44.64,37.19 | 8.52,58.83 8.52,56.84 8.83,56.54 9.74,56.54 10.5,57.3 10.96,57.3 10.96,57.35 D1.A 19.5,48.92 | 9.29,59.59 8.52,58.83 | 22.39,46.02 22.24,46.02 20.56,44.35 18.12,44.35 Q1.1 | 22.39,46.02 22.85,46.02 R2.2 | 22.39,46.02 19.5,48.92 | 17.06,25.3 16.45,25.91 16.14,25.91 R7.2 15.99,26.06 15.99,27.13 14.62,28.5 14.62,30.94 16.75,33.07 | 17.06,25.3 21.17,25.3 Q3.1 | Q2.1 17.97,38.56 v16.14,36.73 16.14,33.98 R16.2 15.99,33.83 16.75,33.07 | R3.2 22.85,38.71 18.12,38.71 Q2.1 | 16.75,33.07 16.91,32.92 22.09,32.92 Q4.1 | 11.88,18.75 12.18,18.44 12.18,17.53 14.77,14.94 14.77,5.49 U$4.+5V | 9.59,18.75 11.88,18.75 | 9.59,18.75 8.52,17.68 U$4.VIN | 9.59,18.75 4.87,23.47 4.87,24.08 J4.2 | 17.06,25.3 17.06,23.93 11.88,18.75 | 19.5,48.92 16.91,46.33 16.91,39.78 17.97,38.71 Q2.1 | 20.11,66.9 20.11,67.67 S1.16 | 129.99,43.59 J2.2 | 8.52,58.83 4.26,58.83 2.88,60.2 2.88,63.7 4.26,65.08 14.93,65.08 | U$2.2 12.23,63.29
  Bottom 0.305: 12.23,63.29 13.66,61.87 15.13,61.87 15.31,62.05 15.31,63.01 S1.16 17.38,65.08 14.93,65.08 | S1.9 52.95,67.81 77.17,43.59 129.99,43.59
  Bottom 0.61: C1.1 9.32,59.62 9.29,59.59
+15V  (via drill 0.35)
  Top 0.152: 5.02,63 5.02,63.09 J5.1 | v56.53,26.52 48.15,18.14 48.15,17.68 47.08,16.61 43.12,16.61 42.97,16.76 42.97,18.14 40.98,20.12 40.98,22.4 R18.2
  Top 0.61: 5.02,63 5.02,62.8 6.98,60.84 6.98,54.62 CN1.PWR
  Bottom 0.152: 13.26,61.26 14.77,59.74 C4.2 14.93,59.74 17,59.74 17.52,59.74 19.8,62.03 38.24,62.03 | 9.74,63.25 U$2.3 | 76.65,41.3 U$3.3 | v56.53,26.52 62,31.99 62,44
  Bottom 0.61: U$2.3 11.01,62.05 11.01,61.98 11.74,61.26 13.26,61.26 13.41,61.26 14.93,59.74 | C4.2 17,59.74 19.38,62.12 43.88,62.12 62,44 64.7,41.3 76.65,41.3 | C6.2 76.77,39.13 U$3.3
  Bottom 1.016: J5.1 9.62,63.13 9.74,63.25
CAN_H
  Top 0.152: U1.7 8.22,37.34 5.32,37.34 4.71,36.73 J1.1
CAN_L
  Top 0.152: U1.6 8.22,38.71 5.17,38.71 4.71,39.17 J1.2
CAN_RX  (via drill 0.35)
  Top 0.152: U1.4 13.71,39.93 v21.94,39.93 34.58,39.93 36.87,42.22 JP1.3
  Bottom 0.152: 21.94,39.62 21.48,39.62 20.87,39.01 19.04,39.01 18.12,39.93 17.52,39.93 17.21,40.23 17.21,45.41 17.97,46.18 Q1.2 | 21.94,39.62 23.61,39.62 23.76,39.78 23.76,41.15 23,41.91 23,44.35 R2.1 | v21.94,39.93 21.94,39.62
CAN_TX
  Top 0.152: U1.1 13.71,36.12 20.41,36.12 23.92,39.62 36.87,39.62 JP1.2
  Bottom 0.152: 21.63,41.45 22.55,40.54 22.85,40.54 R3.1 | 21.63,41.45 18.89,41.45 18.12,40.69 Q2.2 | 21.63,41.45 21.63,44.5 22.39,45.26 23.61,45.26 24.68,46.33 24.68,46.79 25.29,47.4 30.77,47.4 35.19,42.98 35.19,41.45 36.87,39.78 JP1.2
DIN  (via drill 0.35)
  Top 0.152: U$1.4 44.95,57.91 44.19,57.91 37.02,50.75 JP2.3 37.02,50.6 v42.97,44.65
  Bottom 0.152: 45.71,26.21 53.18,26.21 61.71,17.68 U$4.35-TX8 | 45.71,26.21 41.9,26.21 39.77,28.35 39.31,28.35 D5.C | v42.97,44.65 42.97,40.23 45.71,37.49 45.71,26.21
DOUT  (via drill 0.35)
  Top 0.152: 39,55.32 37.02,53.34 JP2.2 | 39,55.32 43.58,59.89 44.95,59.89 U$1.3 | v39.77,54.56 39,55.32
  Bottom 0.152: 64.15,17.37 64.3,17.53 U$4.34-RX8 64.15,17.37 | 64.15,17.37 63.39,16.61 61.41,16.61 60.8,17.22 60.8,17.68 59.73,18.75 45.41,18.75 39.77,24.38 39.31,24.38 D2.C | v39.77,54.56 39.77,48.77 46.17,42.37 46.17,35.36 64.15,17.37
EXTRA
  Top 0.152: U$1.10 45.1,45.87 45.71,45.87 48,43.59 48,36.27 53.63,30.63 65.67,30.63 66.89,29.41 66.89,17.68 U$4.33-MCLK2
GND  (via drill 0.35)
  Top 0.152: R20.1 16.45,55.78 16.45,54.1 R26.1 16.45,53.95 15.99,53.95 14.16,52.12 14.16,50.29 12.49,48.62 9.9,48.62 | 9.9,48.62 6.7,48.62 4.41,50.9 CN1.GND 4.41,51.05 4.87,51.51 4.87,60.2 J5.2 | 8.37,25.45 8.37,35.97 | 8.37,25.45 11.88,21.95 C2.2 12.03,21.79 12.03,19.96 C3.1 11.88,19.81 11.12,19.05 11.12,17.68 U$4.GND6 | 8.37,25.45 8.37,25.3 4.87,21.79 J4.1 | 9.9,48.62 9.9,37.49 8.37,35.97 | 8.37,35.97 U1.8 | 65.37,59.96 65.37,64.92 66.44,65.99 66.89,65.99 U$1.35 | 65.37,59.96 65.37,41 66.28,40.08 66.89,40.08 U$1.22 67.05,39.93 69.03,37.95 v74.21,37.95 | 65.37,59.96 53.6,59.96 U$1.38 51.04,61.11 48.45,61.11 45.71,63.86 45.1,63.86 U$1.1 44.95,63.86 43.73,63.86 36.72,56.84 35.8,56.84 35.19,56.24 35.19,48.16 | 16.45,51.21 16.45,51.97 R27.1 | 16.45,51.21 16.45,50.14 R28.1 16.45,49.99 16.45,48.16 | 26.51,52.27 26.51,53.95 R31.1 26.51,54.1 26.51,55.93 R32.1 | 26.51,52.27 26.51,52.12 R30.1 26.51,52.27 | 16.45,51.21 25.44,51.21 26.51,52.27 | 29,29.26 28.64,29.26 27.88,28.5 25.9,28.5 25.14,29.26 D11.C 24.98,29.26 24.22,28.5 22.09,28.5 21.33,29.26 20.11,29.26 D9.C 19.95,29.41 16.91,29.41 12.33,33.98 12.33,36.58 13.1,37.34 | 29,29.26 29.86,29.26 D13.C | 13.1,37.34 13.55,37.34 U1.2 13.1,37.34 | 16.45,48.16 16.45,44.04 12.64,40.23 12.64,37.8 13.1,37.34 | 40.22,24.69 40.83,25.3 R17.1 40.98,25.45 42.66,27.13 44.03,27.13 | 40.22,24.69 40.07,24.54 36.72,24.54 34.74,22.55 R19.1 | 44.03,27.13 65.37,27.13 65.83,26.67 65.83,25.6 63.24,23.01 62.93,23.01 R33.2 | 40.22,24.69 44.03,20.88 44.03,17.68 U$4.GND3 | 44.03,27.13 44.03,37.49 44.95,38.41 44.95,39.93 U$1.13 45.1,40.08 45.71,40.08 46.78,41.15 46.78,42.82 45.71,43.89 45.1,43.89 U$1.11 44.95,44.04 37.78,44.04 37.02,44.81 JP1.4 37.02,44.96 37.02,48.16 JP2.4 36.87,48.16 35.19,48.16
  Top 0.152: 35.19,48.16 16.45,48.16 | D12.C 28.88,29.38 29,29.26
  Bottom 0.152: 15.69,56.84 15.38,56.54 14.01,56.54 13.25,57.3 R6.1 | 15.69,56.84 15.69,57.91 14.62,58.98 13.86,58.98 13.25,59.59 C4.1 13.1,59.74 11.12,59.74 C1.2 10.96,59.74 10.2,60.5 5.17,60.5 5.02,60.35 J5.2 4.87,60.35 3.19,62.03 3.19,63.55 4.41,64.77 12.94,64.77 14.32,63.4 U$2.1 | 12.18,4.27 21.33,4.27 22.39,5.33 U$4.GND4 22.55,5.33 24.98,5.33 U$4.GND5 | 12.18,4.27 11.42,4.27 9.59,2.44 8.52,2.44 U$4.GND1 | 12.18,4.27 12.18,16.46 11.12,17.53 U$4.GND6 | 77.26,37.03 76.49,37.8 C6.1 | C5.2 81.22,37.03 81.83,36.42 81.83,35.05 R8.1 82,34.98 82,33 76,33 75,34 75,35 76.4,36.4 C6.1 | 81.52,41 81.52,38.41 81.98,37.95 | 81.52,41 81.52,41.3 U$3.1 81.52,41 | 81.52,41 129.99,41 J2.1 | U$4.GND2 54.09,10.06 51.65,10.06 44.19,17.53 U$4.GND3 | v74.21,37.95 76.34,37.95 C6.1 | 15.69,56.84 28.34,56.84 36.87,48.31 JP2.4
  Bottom 0.61: C5.2 | C6.1
  other vias: 55,62 53,64 55,64 53,66 51,66 49,66 49,64 51,64 58,66 60,66 62,66 64,66 64,68 62,68 60,68 58,68 56,68 58,70 56,70 54,70 60,70 62,70 64,70 64,59 59,59 57,59 55,59 53,59 53,57 55,57 57,57 59,57 61,57 63,55 61,55 59,55 57,55 55,55 57,53 59,53 61,53 63,53 59,51 61,51 63,51 63,49 61,49 63,47 59,43 59,41 57,43 57,41 55,41 57,45 55,47 55,45 55,43 53,49 53,47 53,45 53,43 53,41 51,51 51,49 51,47 51,45 51,43 51,41 49,41 49,43 49,45 49,47 49,49 49,51 49,53
  pour Top: 0,72 135,72 135,0 0,0
  pour Bottom: 0,72 135,72 135,0 0,0
IN_A
  Top 0.152: S2.3 59.27,26.21 64.76,26.21 S2.4 | U$4.26-A12/MOSI1 51.81,2.29 52.87,2.29 53.79,1.37 54.7,1.37 55.77,2.44 55.77,22.71 59.12,26.06 S2.3 | S2.3 61.15,24.15 R33.1
N$4
  Bottom 0.152: D3.A 17.82,30.48 17.82,26.06 R7.1
N$5  (via drill 0.35)
  Top 0.152: v21.33,46.02 24.68,46.02 26.51,44.2 | v15.23,28.8 17.21,26.82 17.21,17.22 11.12,11.12 11.12,2.44 U$4.0-RX1/CS1/CRX2 | 26.51,44.2 v24.07,41.76 | 26.51,44.2 v26.66,44.04
  Bottom 0.152: D7.C 28.34,44.04 v26.66,44.04 25.9,44.04 25.59,44.35 R1.1 | v21.33,46.02 20.72,45.41 20.26,45.41 Q1.3 | v15.23,28.8 15.23,31.09 16.6,32.46 22.85,32.46 23.15,32.77 23.15,33.38 22.85,33.68 18.89,33.68 18.43,33.22 17.06,33.22 16.91,33.38 16.91,34.59 20.26,37.95 23.61,37.95 24.07,38.41 v24.07,41.76
N$6
  Bottom 0.152: D5.A 41.14,28.5 43.12,28.5 R13.1
N$7
  Bottom 0.152: D1.C 9.29,57.45 9.74,57.45 10.5,58.22 14.01,58.22 14.77,57.45 R6.2
N$8
  Bottom 0.152: D2.A 41.14,24.38 42.97,24.38 R5.1
N$10
  Bottom 0.152: D4.C 78.17,35.05 80.15,35.05 R8.2
N$11  (via drill 0.35)
  Top 0.152: v26.66,40.84 v21.33,40.84 | v28.03,22.55 27.73,22.25 27.73,6.55 25.29,4.12 25.29,2.44 24.22,1.37 15.69,1.37 14.77,2.29 13.71,2.29 U$4.1-TX1/MISO1/CTX2
  Bottom 0.152: 27.57,40.84 v26.66,40.84 25.9,40.84 25.59,40.54 R4.1 | 27.57,40.84 28.34,40.84 D6.C | v21.33,40.84 20.26,39.78 Q2.3 | v28.03,22.55 28.03,26.06 28.18,26.21 28.18,37.19 27.57,37.8 27.57,40.84
N$12
  Top 0.152: D8.A 34.74,25.6 34.74,26.52 43.27,35.05 43.27,40.84 44.34,41.91 44.95,41.91 U$1.12
N$13
  Bottom 0.152: D7.A 30.16,44.04 30.16,46.48 R15.1
N$14
  Bottom 0.152: D6.A 30.16,40.84 30.16,38.41 R14.1
N$16
  Top 0.152: D9.A 20.11,27.58 20.11,25.45 R21.1
N$18
  Top 0.152: D10.A 22.55,27.58 22.55,25.45 R22.1
N$20
  Top 0.152: D11.A 24.98,27.58 24.98,25.45 R23.1
N$22
  Top 0.152: D12.A 27.57,27.58 27.57,25.45 R24.1
N$24
  Top 0.152: D13.A 30.01,27.58 30.01,25.45 R25.1
N$25
  Top 0.152: D8.C 36.41,25.45 39,25.45 R17.2
POWER_DIVIDED
  Top 0.152: R19.2 36.41,22.55 39,22.55 R18.1 39.16,22.4 39.16,21.49 42.66,17.98 42.66,13.87 54.09,2.44 U$4.27-A13/SCK1
RESET
  Top 0.152: U$1.6 45.1,53.95 49.52,53.95 67.96,35.51 67.96,3.35 67.05,2.44 U$4.32-OUT1B
S_A  (via drill 0.35)
  Top 0.152: 18.28,56.69 18.28,58.22 20.11,60.05 S1.1 | 18.28,56.69 18.28,55.93 R20.2 | v24.07,47.55 27.88,43.74 37.78,43.74 39.46,42.06 39.46,31.7 32.3,24.54 29.4,24.54 28.95,24.08 28.95,17.68 U$4.18-A4/SDA0 | v15.23,55.93 15.53,56.24 15.53,56.39 15.84,56.69 18.28,56.69
  Bottom 0.152: v24.07,47.55 23.61,47.55 v15.23,55.93
S_B
  Top 0.152: S1.2 22.55,60.05 22.55,58.83 18.28,54.56 18.28,54.1 R26.2 18.12,53.95 17.36,53.19 15.69,53.19 14.93,52.43 14.93,50.6 12.03,47.7 12.03,33.83 18.89,26.98 18.89,24.99 19.34,24.54 25.59,24.54 26.2,23.93 26.2,17.68 U$4.19-A5/SCL0
S_C  (via drill 0.35)
  Top 0.152: 18.28,52.73 18.28,52.12 R27.2 | 18.28,52.73 25.14,59.59 25.14,60.05 S1.3 | v27.12,31.39 29.55,31.39 29.86,31.7 29.86,32.31 27.27,34.9 v14.62,34.9 | v15.53,51.05 15.53,52.58 15.69,52.73 18.28,52.73
  Bottom 0.152: v27.12,31.39 22.39,26.67 22.39,25.91 23.61,24.69 23.61,17.68 U$4.20-A6/TX5/LRCLK1 | v14.62,34.9 14.62,50.14 v15.53,51.05
S_D
  Top 0.152: R28.2 18.28,50.14 24.83,50.14 26.05,51.36 27.27,51.36 27.42,51.51 27.42,59.74 27.73,60.05 S1.4
  Bottom 0.152: U$4.21-A7/RX5/BCLK1 21.33,17.53 22.39,17.53 23.31,16.61 31.84,16.61 32.91,17.68 32.91,26.98 42.51,36.58 44.95,36.58 45.25,36.88 45.25,37.49 39.16,43.59 39.16,55.93 36.72,58.37 29.55,58.37 27.88,60.05 S1.4
S_E  (via drill 0.35)
  Top 0.152: R32.2 28.34,56.08 28.34,58.22 30.16,60.05 S1.5 30.16,60.2 28.34,62.03 19.8,62.03 13.55,55.78 v13.55,50.6 | v11.72,33.22 18.58,26.36 18.58,17.68 U$4.22-A8/CTX1
  Bottom 0.152: v11.72,33.22 11.72,48.77 v13.55,50.6
S_F
  Top 0.152: R31.2 28.34,54.1 28.34,54.71 32.76,59.13 32.76,60.05 S1.6 32.76,60.2 28.79,64.16 3.8,64.16 2.12,62.48 2.12,22.4 8.07,16.46 13.86,16.46 14.93,17.53 15.99,17.53 U$4.23-A9/CRX1/MCLK1
S_G  (via drill 0.35)
  Top 0.152: S1.7 35.35,60.05 35.35,59.74 28.34,52.73 28.34,52.12 R30.2 28.34,51.97 27.42,51.05 26.2,51.05 24.07,48.92 v18.58,48.92
  Bottom 0.152: v18.58,48.92 15.23,45.57 15.23,33.83 6.85,25.45 4.26,25.45 3.5,24.69 3.5,5.49 7.61,1.37 44.64,1.37 45.56,2.29 46.47,2.29 U$4.24-A10/TX6/SCL2
S_H
  Top 0.152: R29.2 28.34,50.14 28.34,50.6 37.78,60.05 S1.8
  Bottom 0.152: U$4.25-A11/RX6/SDA2 49.22,2.44 50.28,2.44 54.24,6.4 54.7,6.4 65.52,17.22 65.52,17.98 57.6,25.91 56.23,25.91 46.47,35.66 46.47,51.51 37.94,60.05 S1.8
SCL
  Bottom 0.152: 25.59,33.22 24.98,33.22 24.37,33.83 Q4.3 | 25.59,33.22 26.96,33.22 R12.1 | 25.59,33.22 25.59,30.33 22.09,26.82 22.09,19.96 20.11,17.98 20.11,17.22 21.02,16.31 32.6,16.31 33.82,17.53 U$4.16-A2/RX4/SCL1
SCL_BUS  (via drill 0.35)
  Top 0.152: v29.25,32 v24.98,32 22.7,34.29 v13.86,34.29 | v48.15,4.42 35.04,17.53 35.04,20.73 v31.84,23.93
  Bottom 0.152: 22.09,34.9 21.17,33.98 17.82,33.98 R16.1 | 22.09,34.9 v24.98,32 | R11.1 29.55,33.07 29.55,32.31 v29.25,32 31.84,29.41 v31.84,23.93 | 22.09,34.9 Q4.2 | v13.86,34.29 8.98,29.41 4.87,29.41 J4.4 | v48.15,4.42 48.15,1.98 48.76,1.37 92.04,1.37 131.21,40.54 131.21,46.63 130.14,47.7 130.14,48.62 J2.4
SDA
  Bottom 0.152: 26.2,27.13 24.07,27.13 23.31,26.36 Q3.3 | 26.2,27.13 26.96,27.13 R9.1 | 26.2,27.13 26.2,22.71 31.23,17.68 U$4.17-A3/TX4/SDA1
SDA_BUS  (via drill 0.35)
  Top 0.152: v29.25,30.33 v23.31,30.33 20.26,33.38 v13.86,33.38
  Bottom 0.152: 21.17,28.5 18.28,31.39 17.36,31.39 16.6,30.63 16.14,30.63 D3.C | 21.17,28.5 21.17,27.43 Q3.2 | v29.25,30.33 29.55,30.02 29.55,27.28 R10.1 | v23.31,30.33 23,30.33 21.17,28.5 | v13.86,33.38 7.3,26.82 4.87,26.82 J4.3 4.71,26.82 2.12,29.41 2.12,63.4 4.1,65.38 11.27,65.38 15.53,69.65 51.65,69.65 75.12,46.18 129.99,46.18 J2.3
STATUS1
  Top 0.152: R21.2 19.95,23.62 19.95,9.45 16.14,5.64 16.14,2.44 U$4.2-OUT2
STATUS2
  Top 0.152: R22.2 22.39,23.62 22.39,9.3 18.73,5.64 18.73,2.44 U$4.3-LRCLK2
STATUS3
  Top 0.152: R23.2 24.98,23.62 24.98,9.3 21.33,5.64 21.33,2.44 U$4.4-BCLK2
STATUS4
  Top 0.152: R24.2 27.42,23.62 27.42,9.3 23.76,5.64 23.76,2.44 U$4.5-IN2
STATUS5
  Top 0.152: R25.2 29.86,23.62 29.86,5.94 26.36,2.44 U$4.6-OUT1D
VCC
  Bottom 0.152: R9.2 27.12,25.6 27.88,26.36 27.88,33.98 27.12,34.75 R12.2 26.96,34.9 25.59,36.27 25.59,38.71 R4.2 25.44,38.86 24.68,39.62 24.68,45.26 25.44,46.02 R1.2
(copper drawn outside any net)
  shapes: Top area x4

### Text on the board
tNames: FREQ_SET | PWR | GND | CAN | 3.3 DIN DOUT GND | GND 5 SDA SCL | 5 TX RX GND | CAN_H CAN_L | GND 5 SDA SCL